# EAGLE schematic f7_General (EAGLE 7.2.0)
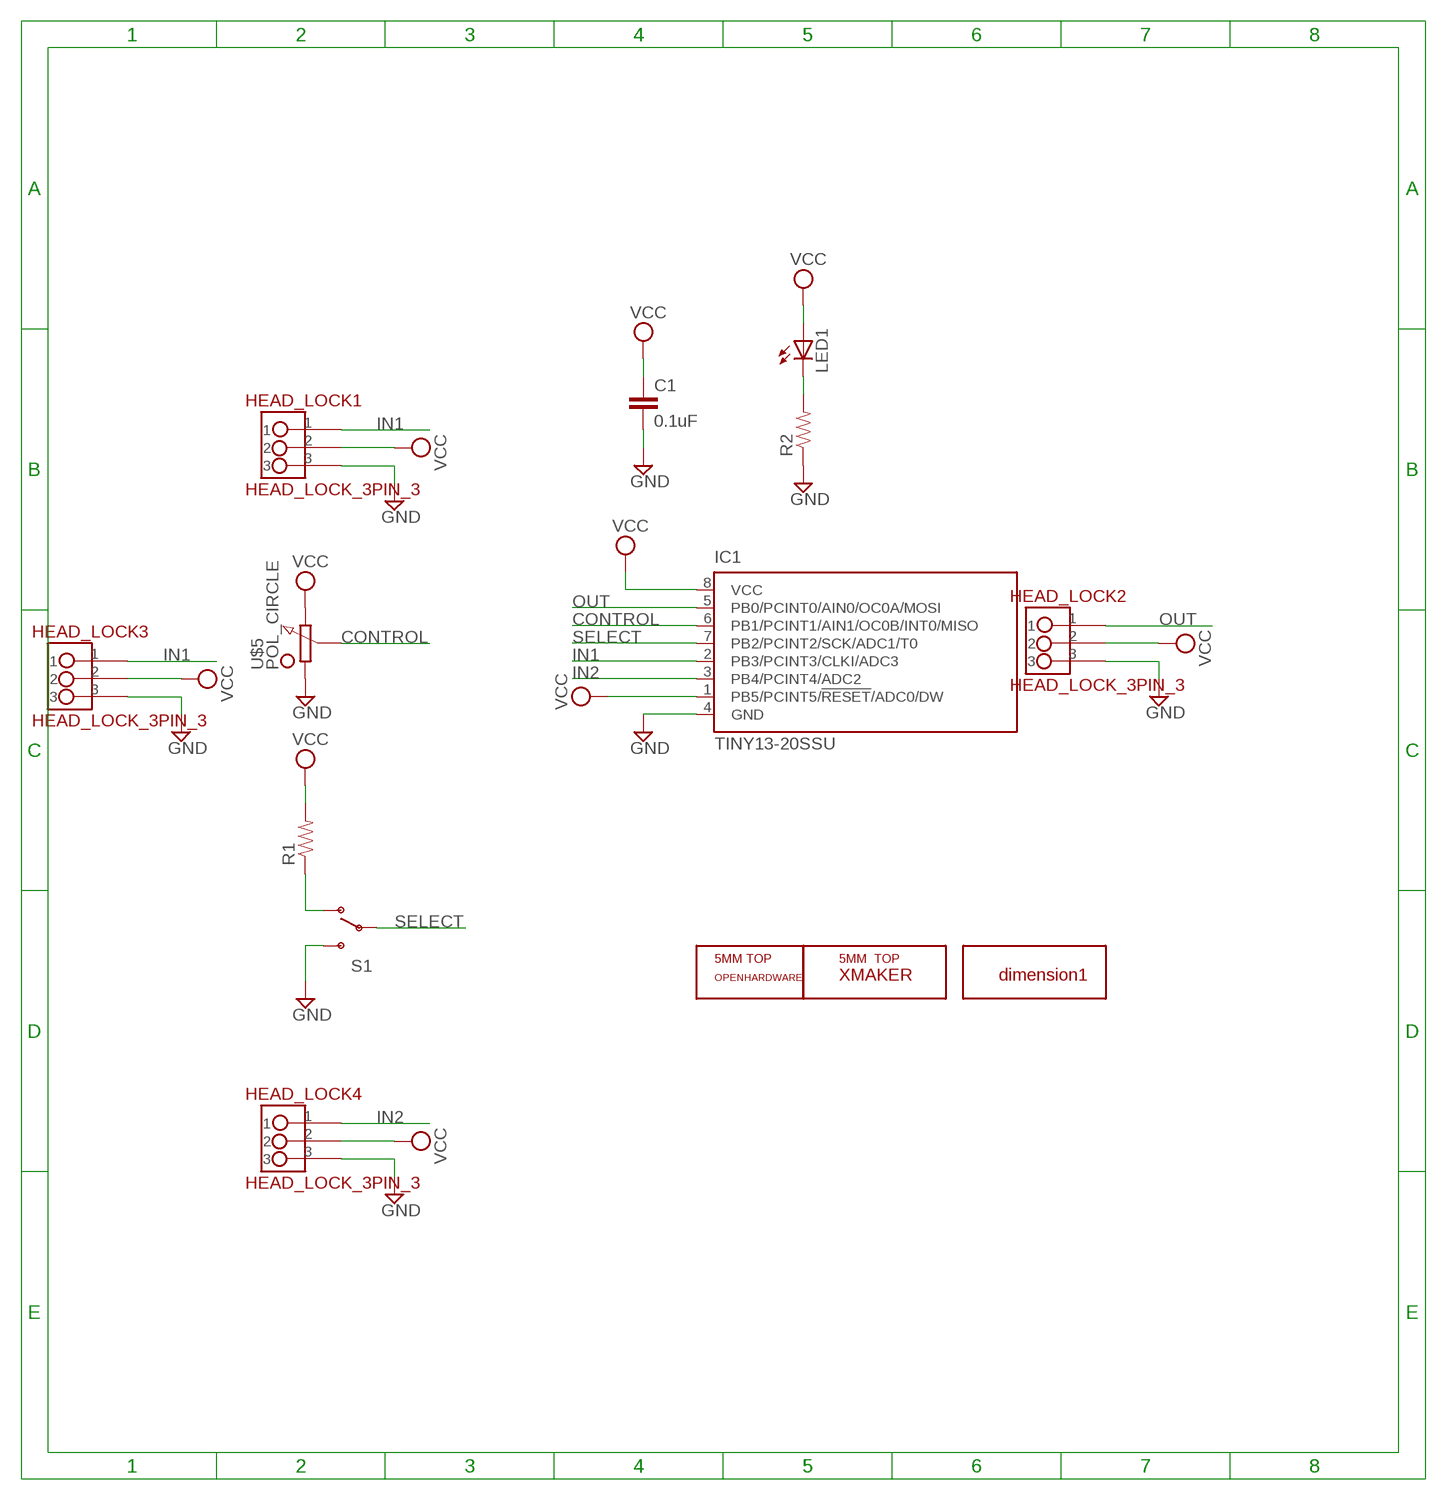
[diagram p0: schematic, sheet 1]

## Parts
C1  0.1uF  CAP0603-CAP  [0603-CAP]
HEAD_LOCK1  HEAD_LOCK_3PIN_3  [HEAD_LOCK_3PIN_3]
HEAD_LOCK2  HEAD_LOCK_3PIN_3  [HEAD_LOCK_3PIN_3]
HEAD_LOCK3  HEAD_LOCK_3PIN_3  [HEAD_LOCK_3PIN_3]
HEAD_LOCK4  HEAD_LOCK_3PIN_3  [HEAD_LOCK_3PIN_3]
IC1  TINY13-20SSU  [8S1]
LED1  LED_ESML0603  [LED_SML0603]
R1  RESISTOR0603-RES  [0603-RES]
R2  0.27OHM-1/10W-1%(0603)  [0603-RES]
S1  SWITCH-SPDTKIT  [SWITCH-SPDT_KIT]
U$2  XMAKERLOGO_5MM_TOP  [XMAKERLOGO_5MM_TOP]
U$3  DIMENSION1  [DIMENSION1]
U$4  OPENHARDWARE_5MM_TOP  [OPENSOURCE_5MM_TOP]
U$5  POL_CIRCLE  [POT_CIRCLE]

## Nets
CONTROL: IC1.6(PB1/PCINT1/AIN1/OC0B/INT0/MISO) U$5.P$2
GND: C1.2 HEAD_LOCK1.3 HEAD_LOCK2.3 HEAD_LOCK3.3 HEAD_LOCK4.3 IC1.4(GND) R2.1 S1.3(S) U$5.P$3
IN1: HEAD_LOCK1.1 HEAD_LOCK3.1 IC1.2(PB3/PCINT3/CLKI/ADC3)
IN2: HEAD_LOCK4.1 IC1.3(PB4/PCINT4/ADC2)
N$1: LED1.C R2.2
N$2: R1.1 S1.1(O)
OUT: HEAD_LOCK2.1 IC1.5(PB0/PCINT0/AIN0/OC0A/MOSI)
SELECT: IC1.7(PB2/PCINT2/SCK/ADC1/T0) S1.2(P)
VCC: C1.1 HEAD_LOCK1.2 HEAD_LOCK2.2 HEAD_LOCK3.2 HEAD_LOCK4.2 IC1.1(PB5/PCINT5/!RESET!/ADC0/DW) IC1.8(VCC) LED1.A R1.2 U$5.P$1

## Library data of the parts
C1 = SparkFun-Passives:CAP: Capacitor Standard 0603 ceramic capacitor, and 0.1" leaded capacitor.
HEAD_LOCK1-HEAD_LOCK4 = Xmaker:HEAD_LOCK_3PIN_3
IC1 = atmel:TINY13: 8-bit AVR Microcontroller with 1K Bytes In-System Programmable Flash Source: http://www.atmel.com/dyn/resources/prod_documents/2535S.pdf; MPN: ATTINY13-20SSU; OC_FARNELL: 1455133; OC_NEWARK: 58M3771
LED1 = eagle-ltspice:LED_E: LED Source: http://www.osram.convergy.de Source: www.luxeon.com Source: www.kingbright.com; SPICEMODEL: NONE; SPICEPREFIX: D; SPICETYPE: diode
R1 = SparkFun-Passives:RESISTOR: Resistor Basic schematic elements and footprints for 0603, 1206, and PTH resistors.
R2 = SparkFun-Resistors:0.27OHM-1/10W-1%(0603): RES-08787; PROD_ID: RES-08787
S1 = SparkFun-Electromechanical:SWITCH-SPDT: SPDT Switch Simple slide switch, Spark Fun Electronics SKU : COM-00102 DPDT SMT slide switch, AYZ0202, SWCH-08179; PROD_ID: SWCH-08261
U$2 = Xmaker_yuhui:XMAKERLOGO_5MM_TOP
U$3 = Xmaker_yuhui:DIMENSION1
U$4 = Xmaker_yuhui:OPENHARDWARE_5MM_TOP
U$5 = Xmaker:POL_CIRCLE